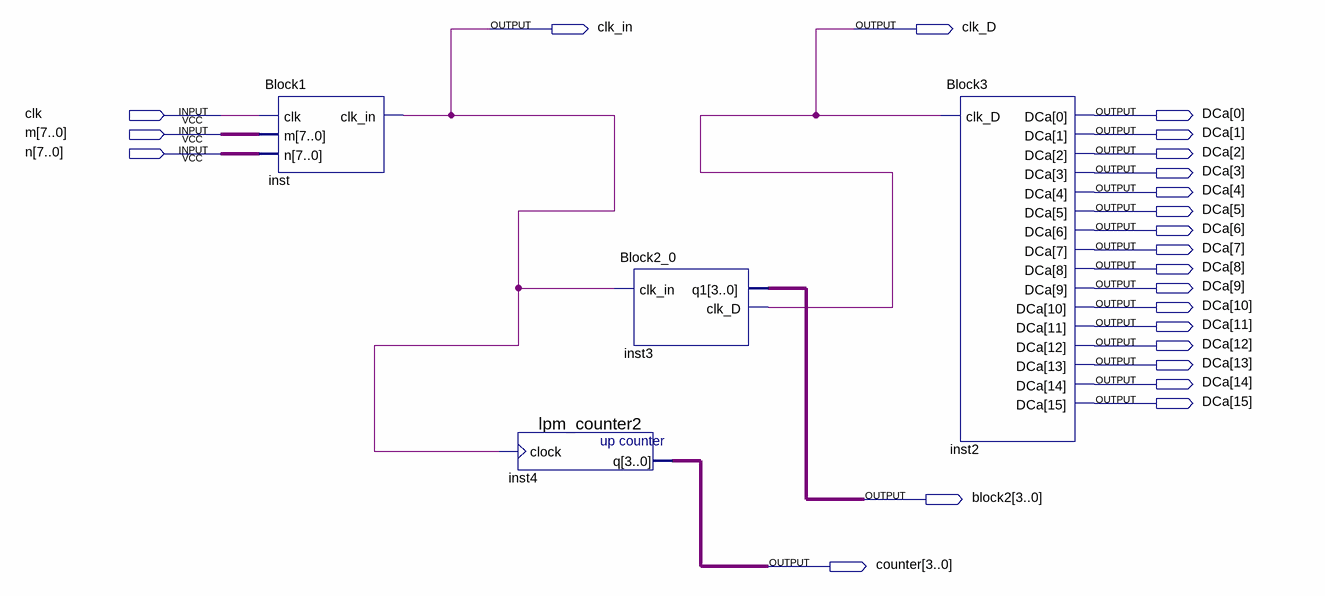
[diagram p0: schematic sheet]
// Quartus schematic Lab2.bdf as structural Verilog: 4 symbols, 23 pins
module Lab2 (
  input  clk,
  input  [7:0] m,
  input  [7:0] n,
  output clk_in,
  output clk_D,
  output [15:0] DCa,
  output [3:0] block2,
  output [3:0] counter
);

  Block1 inst (.clk(clk), .m(m), .n(n), .clk_in(clk_in));
  lpm_counter2 inst4 (.clock(clk_in), .q(counter));
  Block2_0 inst3 (.clk_in(clk_in), .q1(block2), .clk_D(clk_D));
  Block3 inst2 (.clk_D(clk_D), .DCa(DCa));
endmodule
